# EAGLE design Open_Notify (EAGLE 5.11)
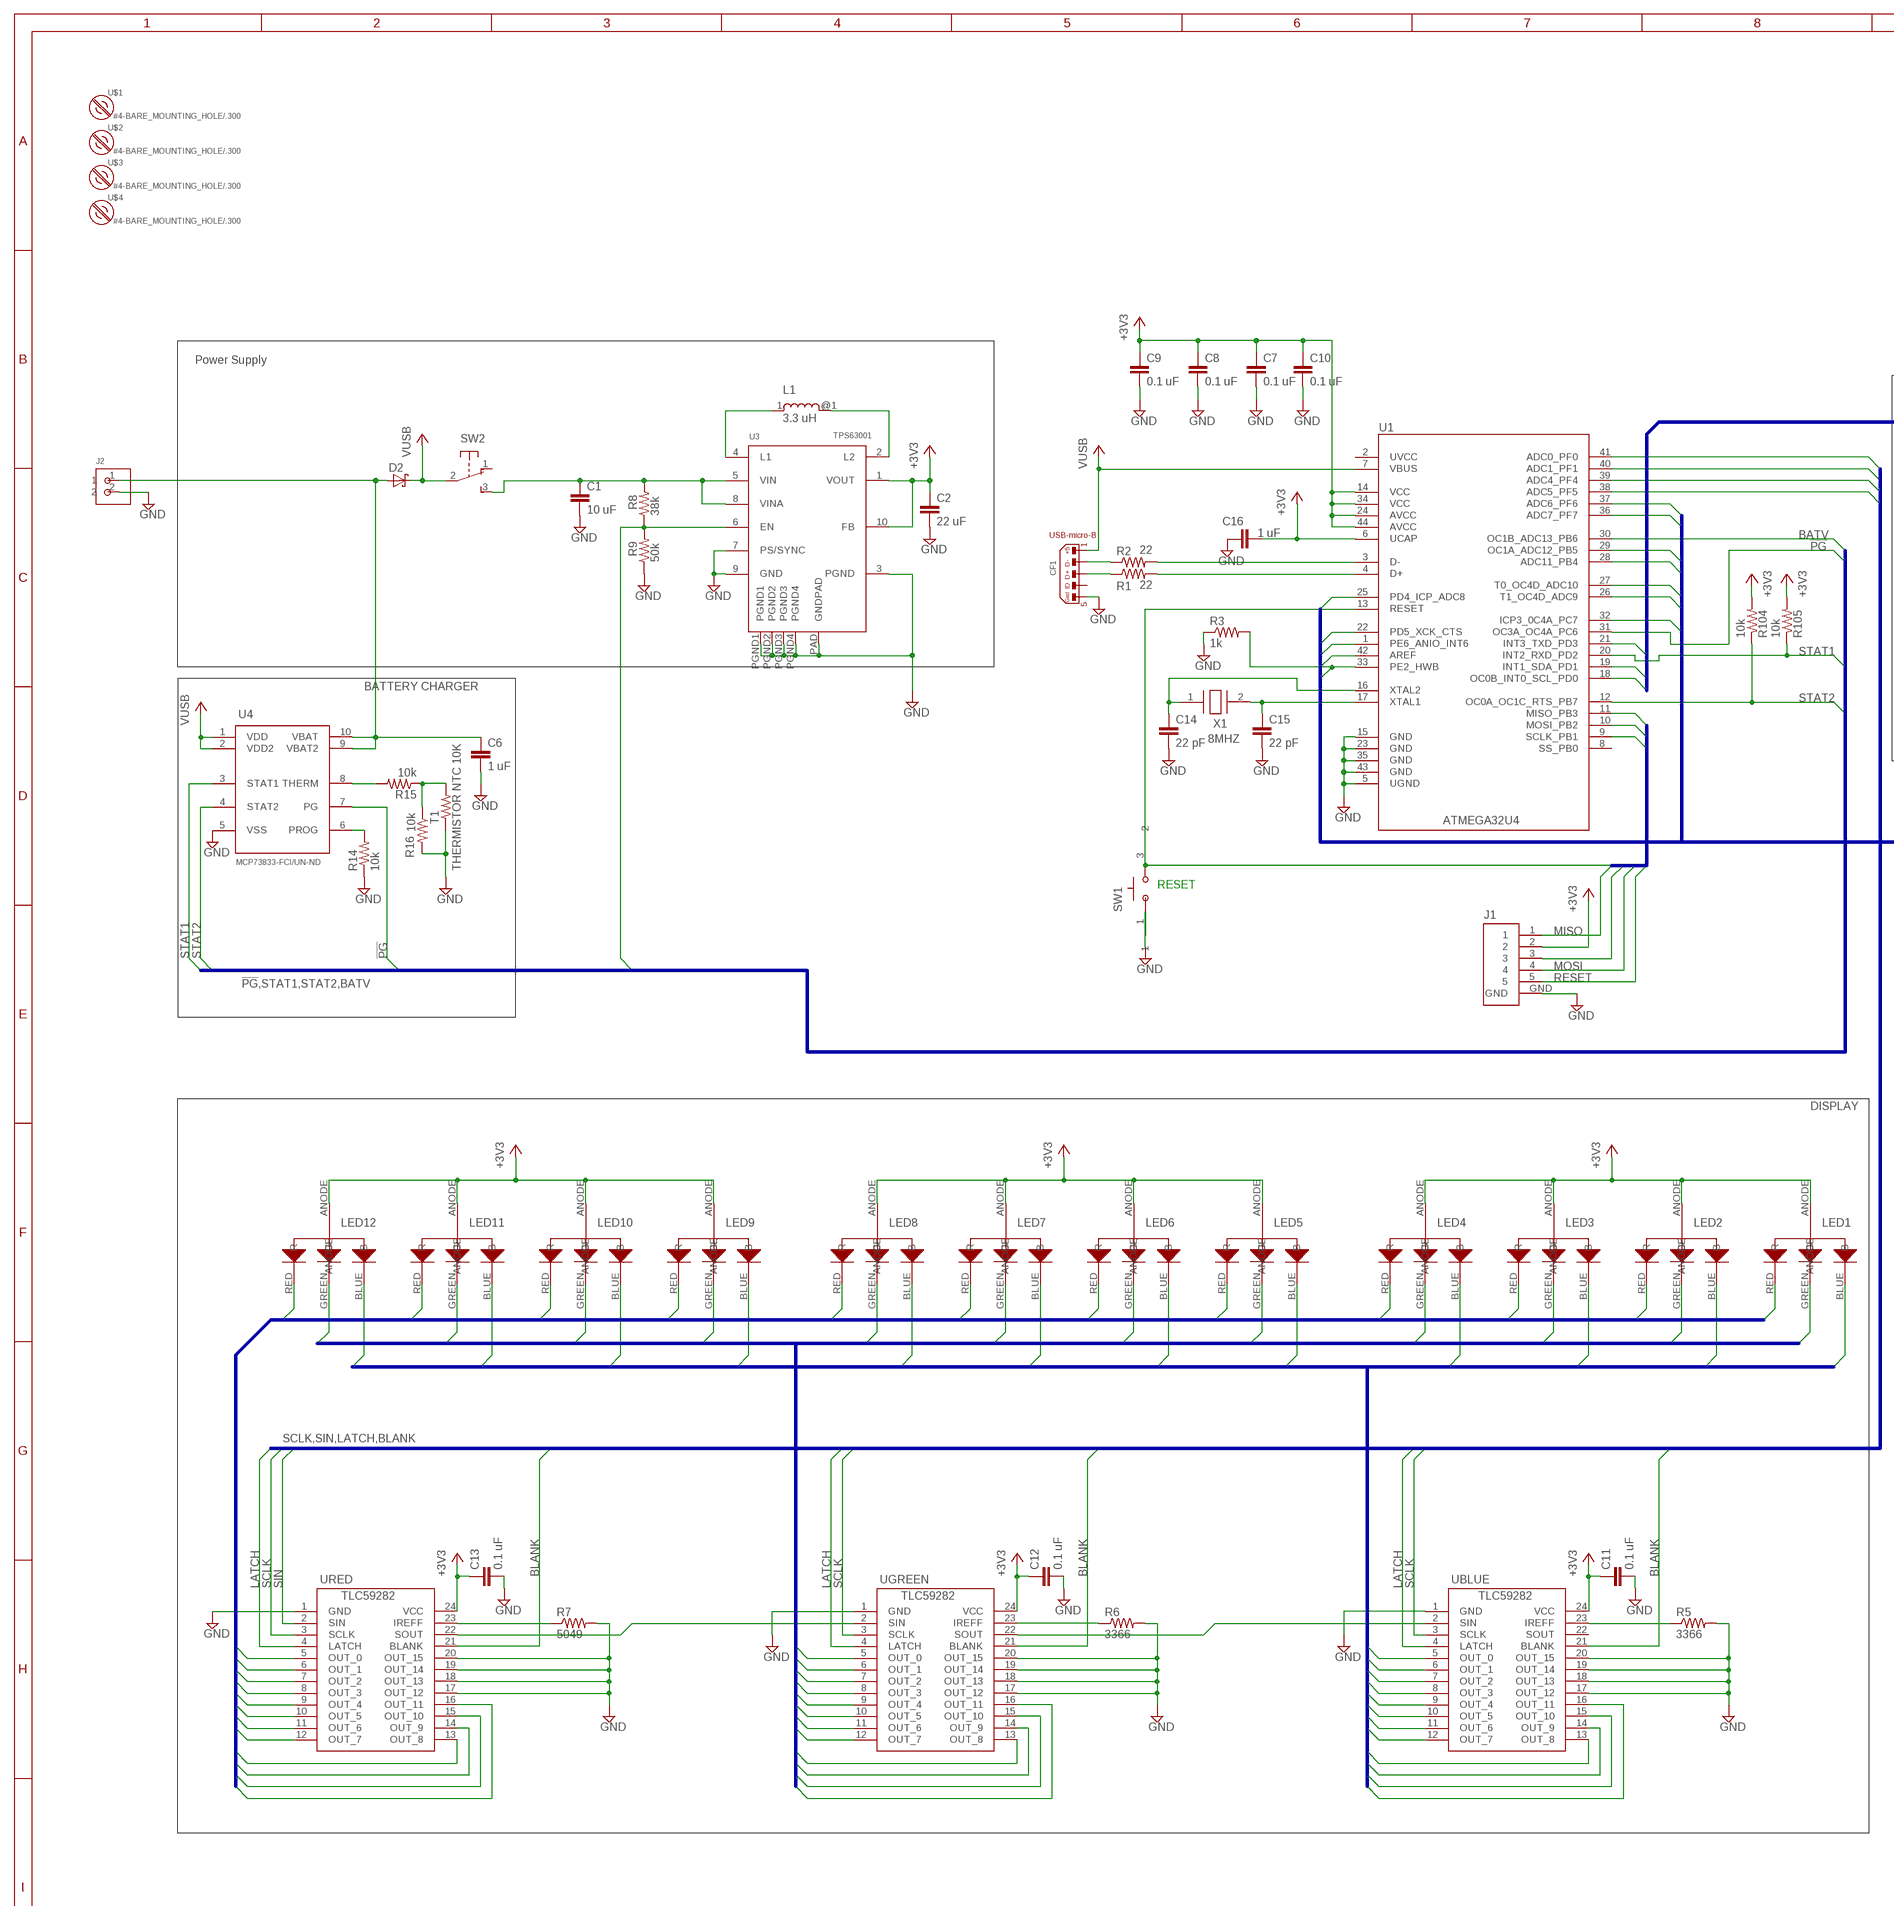
[diagram p0: schematic, sheet 1, part 1 of 2]
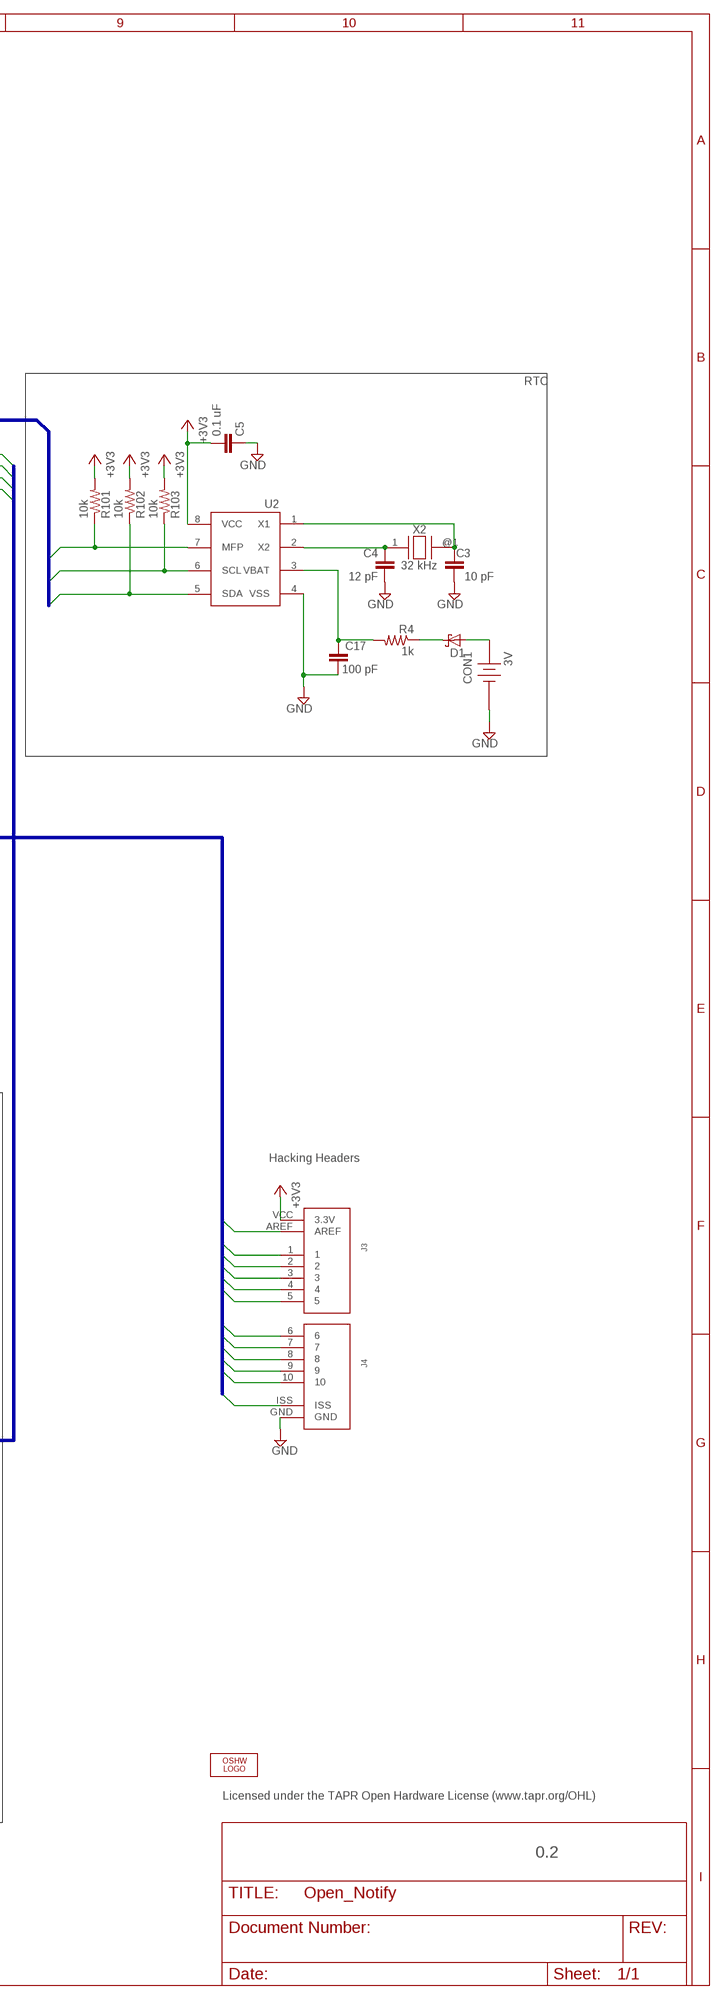
[diagram p1: schematic, sheet 1, part 2 of 2]

## Parts
C1  10 uF  C-EUC0805  [C0805]
C2  22 uF  C-EUC0805  [C0805]
C3  10 pF  C-EUC0805  [C0805]
C4  12 pF  C-EUC0805  [C0805]
C5  0.1 uF  C-EUC0805  [C0805]
C6  1 uF  C-EUC0805  [C0805]
C7  0.1 uF  C-EUC0805  [C0805]
C8  0.1 uF  C-EUC0805  [C0805]
C9  0.1 uF  C-EUC0805  [C0805]
C10  0.1 uF  C-EUC0805  [C0805]
C11  0.1 uF  C-EUC0805  [C0805]
C12  0.1 uF  C-EUC0805  [C0805]
C13  0.1 uF  C-EUC0805  [C0805]
C14  22 pF  C-EUC0805  [C0805]
C15  22 pF  C-EUC0805  [C0805]
C16  1 uF  C-EUC0805  [C0805]
C17  100 pF  C-EUC0805  [C0805]
CF1  CON_USB-MICRO-6GND  [USBMICROSMT]
CON1  3V  COINCELL  [COINCELL]
D1  MBR120  [MBR120]
D2  MBR120  [MBR120]
J1  AVRISP  [AVRISP]
J2  JST2  [JSTHEAD]
J3  PROTOSPACE  [PROTOSPACE]
J4  PROTOSPACE2  [PROTOSPACE2]
L1  3.3 uH  CB2518  [SMD1007]
LED1  RGBLED  [SMDRGBLED]
LED2  RGBLED  [SMDRGBLED]
LED3  RGBLED  [SMDRGBLED]
LED4  RGBLED  [SMDRGBLED]
LED5  RGBLED  [SMDRGBLED]
LED6  RGBLED  [SMDRGBLED]
LED7  RGBLED  [SMDRGBLED]
LED8  RGBLED  [SMDRGBLED]
LED9  RGBLED  [SMDRGBLED]
LED10  RGBLED  [SMDRGBLED]
LED11  RGBLED  [SMDRGBLED]
LED12  RGBLED  [SMDRGBLED]
LOGO1  OSHW_LOGO_FILLX0100-NT  [OSHW_FILLX100_NOTEXT]
R1  22  R-US_R0805  [R0805]
R2  22  R-US_R0805  [R0805]
R3  1k  R-US_R0805  [R0805]
R4  1k  R-US_R0805  [R0805]
R5  3366  R-US_R0805  [R0805]
R6  3366  R-US_R0805  [R0805]
R7  5049  R-US_R0805  [R0805]
R8  38k  R-US_R0805  [R0805]
R9  50k  R-US_R0805  [R0805]
R14  10k  R-US_R0805  [R0805]
R15  10k  R-US_R0805  [R0805]
R16  10k  R-US_R0805  [R0805]
R101  10k  R-US_R0805  [R0805]
R102  10k  R-US_R0805  [R0805]
R103  10k  R-US_R0805  [R0805]
R104  10k  R-US_R0805  [R0805]
R105  10k  R-US_R0805  [R0805]
SW1  SWITCH  [SWITCH]
SW2  9077-1  [ESWITCH]
T1  THERMISTOR NTC 10K  R-US_R0805  [R0805]
U1  ATMEGA32U4  [TQFP-44]
U2  MCP7940N  [MCP7940N]
U3  TPS63001  [QFN10]
U4  MCP73833  [10-MSOP]
U$1  #4-BARE_MOUNTING_HOLE/.300  [#4/.300-BARE+STD_NUT_OR_STAR_WASHER]
U$2  #4-BARE_MOUNTING_HOLE/.300  [#4/.300-BARE+STD_NUT_OR_STAR_WASHER]
U$3  #4-BARE_MOUNTING_HOLE/.300  [#4/.300-BARE+STD_NUT_OR_STAR_WASHER]
U$4  #4-BARE_MOUNTING_HOLE/.300  [#4/.300-BARE+STD_NUT_OR_STAR_WASHER]
UBLUE  TLC59282  [24SSOP]
UGREEN  TLC59282  [24SSOP]
URED  TLC59282  [24SSOP]
X1  8MHZ  8MHZXTAL  [8MHXTAL]
X2  32 kHz  ABS10  [ABS10]

## Nets
!PG: U1.31(OC3A_OC4A_PC6) U4.7(PG)
+3V3: C2.1 C5.2 C7.1 C8.1 C9.1 C10.1 C11.1 C12.1 C13.1 C16.1 J1.2 J3.VCC(3.3V) LED1.ANODE LED2.ANODE LED3.ANODE LED4.ANODE LED5.ANODE LED6.ANODE LED7.ANODE LED8.ANODE LED9.ANODE LED10.ANODE LED11.ANODE LED12.ANODE R101.2 R102.2 R103.2 R104.2 R105.2 U1.6(UCAP) U1.14(VCC) U1.24(AVCC) U1.34(VCC) U1.44(AVCC) U2.8(VCC) U3.1(VOUT) U3.10(FB) UBLUE.24(VCC) UGREEN.24(VCC) URED.24(VCC)
B1: LED1.BLUE(B) UBLUE.5(OUT_0)
B2: LED2.BLUE(B) UBLUE.6(OUT_1)
B3: LED3.BLUE(B) UBLUE.7(OUT_2)
B4: LED4.BLUE(B) UBLUE.8(OUT_3)
B5: LED5.BLUE(B) UBLUE.9(OUT_4)
B6: LED6.BLUE(B) UBLUE.10(OUT_5)
B7: LED7.BLUE(B) UBLUE.11(OUT_6)
B8: LED8.BLUE(B) UBLUE.12(OUT_7)
B9: LED9.BLUE(B) UBLUE.13(OUT_8)
B10: LED10.BLUE(B) UBLUE.14(OUT_9)
B11: LED11.BLUE(B) UBLUE.15(OUT_10)
B12: LED12.BLUE(B) UBLUE.16(OUT_11)
BATV: R8.1 R9.2 U1.30(OC1B_ADC13_PB6) U3.6(EN)
BLANK: U1.38(ADC5_PF5) UBLUE.21(BLANK) UGREEN.21(BLANK) URED.21(BLANK)
D+: R1.2 U1.4(D+)
D-: R2.2 U1.3(D-)
G1: LED1.GREEN(G) UGREEN.5(OUT_0)
G2: LED2.GREEN(G) UGREEN.6(OUT_1)
G3: LED3.GREEN(G) UGREEN.7(OUT_2)
G4: LED4.GREEN(G) UGREEN.8(OUT_3)
G5: LED5.GREEN(G) UGREEN.9(OUT_4)
G6: LED6.GREEN(G) UGREEN.10(OUT_5)
G7: LED7.GREEN(G) UGREEN.11(OUT_6)
G8: LED8.GREEN(G) UGREEN.12(OUT_7)
G9: LED9.GREEN(G) UGREEN.13(OUT_8)
G10: LED10.GREEN(G) UGREEN.14(OUT_9)
G11: LED11.GREEN(G) UGREEN.15(OUT_10)
G12: LED12.GREEN(G) UGREEN.16(OUT_11)
GND: C1.2 C2.2 C3.2 C4.2 C5.1 C6.2 C7.2 C8.2 C9.2 C10.2 C11.2 C12.2 C13.2 C14.2 C15.2 C16.2 C17.2 CF1.5 CON1.GND J1.GND J2.2 J4.GND R3.1 R5.2 R6.2 R7.2 R9.1 R14.1 R16.2 SW1.1 T1.1 U1.5(UGND) U1.15(GND) U1.23(GND) U1.35(GND) U1.43(GND) U2.4(VSS) U3.3(PGND) U3.7(PS/SYNC) U3.9(GND) U3.PAD(GNDPAD) U3.PGND1 U3.PGND2 U3.PGND3 U3.PGND4 U4.5(VSS) UBLUE.1(GND) UBLUE.17(OUT_12) UBLUE.18(OUT_13) UBLUE.19(OUT_14) UBLUE.20(OUT_15) UGREEN.1(GND) UGREEN.17(OUT_12) UGREEN.18(OUT_13) UGREEN.19(OUT_14) UGREEN.20(OUT_15) URED.1(GND) URED.17(OUT_12) URED.18(OUT_13) URED.19(OUT_14) URED.20(OUT_15)
ISCLK: J1.3 U1.9(SCLK_PB1)
LATCH: U1.39(ADC4_PF4) UBLUE.4(LATCH) UGREEN.4(LATCH) URED.4(LATCH)
MISO: J1.1 U1.11(MISO_PB3)
MOSI: J1.4 U1.10(MOSI_PB2)
N$1: CF1.D- R2.1
N$2: CF1.D+ R1.1
N$3: R14.2 U4.6(PROG)
N$4: C17.1 R4.2 U2.3(VBAT)
N$5: CON1.POS1(VBAT) D1.A
N$6: D1.C R4.1
N$7: C4.1 U2.2(X2) X2.1
N$8: R15.1 R16.1 T1.2
N$10: C3.1 U2.1(X1) X2.@1
N$12: L1.1 U3.4(L1)
N$14: L1.@1 U3.2(L2)
N$15: R15.2 U4.8(THERM)
N$18: UGREEN.2(SIN) URED.22(SOUT)
N$19: UBLUE.2(SIN) UGREEN.22(SOUT)
N$21: R7.1 URED.23(IREFF)
N$22: R6.1 UGREEN.23(IREFF)
N$23: R5.1 UBLUE.23(IREFF)
N$56: C15.1 U1.17(XTAL1) X1.2
N$57: C14.1 U1.16(XTAL2) X1.1
P1: J3.1 U1.37(ADC6_PF6)
P2: J3.2 U1.36(ADC7_PF7)
P3: J3.3 U1.29(OC1A_ADC12_PB5)
P4: J3.4 U1.28(ADC11_PB4)
P5: J3.5 U1.27(T0_OC4D_ADC10)
P6: J4.6 U1.26(T1_OC4D_ADC9)
P7: J4.7 U1.32(ICP3_0C4A_PC7)
P8: J4.8 U1.22(PD5_XCK_CTS)
P9: J4.9 U1.1(PE6_ANIO_INT6)
P10: J4.10 R3.2 U1.33(PE2_HWB)
P_AREF: J3.AREF U1.42(AREF)
P_ISS: J4.ISS U1.25(PD4_ICP_ADC8)
R1: LED1.RED(R) URED.5(OUT_0)
R2: LED2.RED(R) URED.6(OUT_1)
R3: LED3.RED(R) URED.7(OUT_2)
R4: LED4.RED(R) URED.8(OUT_3)
R5: LED5.RED(R) URED.9(OUT_4)
R6: LED6.RED(R) URED.10(OUT_5)
R7: LED7.RED(R) URED.11(OUT_6)
R8: LED8.RED(R) URED.12(OUT_7)
R9: LED9.RED(R) URED.13(OUT_8)
R10: LED10.RED(R) URED.14(OUT_9)
R11: LED11.RED(R) URED.15(OUT_10)
R12: LED12.RED(R) URED.16(OUT_11)
RESET: J1.5 SW1.3 U1.13(RESET)
RTC-ALARM: R101.1 U1.21(INT3_TXD_PD3) U2.7(MFP)
RTC-SCL: R103.1 U1.18(OC0B_INT0_SCL_PD0) U2.6(SCL)
RTC-SDA: R102.1 U1.19(INT1_SDA_PD1) U2.5(SDA)
SCLK: U1.41(ADC0_PF0) UBLUE.3(SCLK) UGREEN.3(SCLK) URED.3(SCLK)
SIN: U1.40(ADC1_PF1) URED.2(SIN)
STAT1: R105.1 U1.20(INT2_RXD_PD2) U4.3(STAT1)
STAT2: R104.1 U1.12(OC0A_OC1C_RTS_PB7) U4.4(STAT2)
VBAT: C6.1 D2.A J2.1 U4.9(VBAT2) U4.10(VBAT)
VIN: C1.1 R8.2 SW2.3(S) U3.5(VIN) U3.8(VINA)
VUSB: CF1.VUSB D2.C SW2.2(P) U1.7(VBUS) U4.1(VDD) U4.2(VDD2)
Unconnected: CF1.4 SW2.1(O) U1.8(SS_PB0) UBLUE.22(SOUT)

## Buses
RTC-ALARM,RTC-SCL,RTC-SDA
!PG,STAT1,STAT2,BATV
R1,R2,R3,R4,R5,R6,R7,R8,R9,R10,R11,R12
G1,G2,G3,G4,G5,G6,G7,G8,G9,G10,G11,G12
B1,B2,B3,B4,B5,B6,B7,B8,B9,B10,B11,B12
SCLK,SIN,LATCH,BLANK
MISO,MOSI,ISCLK,RESET
P1,P2,P3,P4,P5,P6,P7,P8,P9,P10,P_ISS,P_AREF

## Notes on the sheet
- Power Supply
- RTC
- BATTERY CHARGER
- ATMEGA32U4
- RESET
- DISPLAY
- Hacking Headers
- TLC59282 | TLC59282 | TLC59282
- Licensed under the TAPR Open Hardware License (www.tapr.org/OHL)
- 0.2

## Power pins joined to a net without a drawn wire
UVCC: U1.2(UVCC)

## Library data of the parts
C1-C17 = rcl:C-EU: CAPACITOR, European symbol
CF1 = parts:CON_USB-MICRO-6GND: Micro USB connector
CON1 = parts:COINCELL
D1 D2 = parts:MBR120: Schottky Power Rectifier
J1 = parts:AVRISP: ISP header for AVR
J2 = parts:JST2
J3 = parts:PROTOSPACE
J4 = parts:PROTOSPACE2
L1 = parts:CB2518: 3.3 uH Inductor
LED1-LED12 = parts:RGBLED
LOGO1 = OSHW:OSHW_LOGO_FILL
R1-R9 R14-R16 R101-R105 T1 = resistor:R-US_: RESISTOR, American symbol
SW1 = parts:SWITCH: Tall micro push button
SW2 = parts:9077-1: MARQUARDT SWITCH 9077.0100 Distributor: Buerklin <https://www.buerklin.com/default.asp?event=ShowArtikel%2812G2820%29&l=d&jump=ArtNr_12G2820>
U1 = parts:ATMEGA32U4: ATMega32U4 AVR embedded microcontroller with USB, UART, SPI, I2C, 32K program space, 1K eeprom, 2.5 K sram
U2 = parts:MCP7940N: Low Power Real Time Clock
U3 = parts:TPS63001: High efficiency buck boost SPS
U4 = parts:MCP73833
U$1-U$4 = mount:#4-BARE_MOUNTING_HOLE: 1/8" drill hole for #4 screw mount
UBLUE UGREEN URED = parts:TLC59282
X1 = parts:8MHZXTAL
X2 = parts:ABS10: 32.768 kHz Crystal 7 pF

## Board
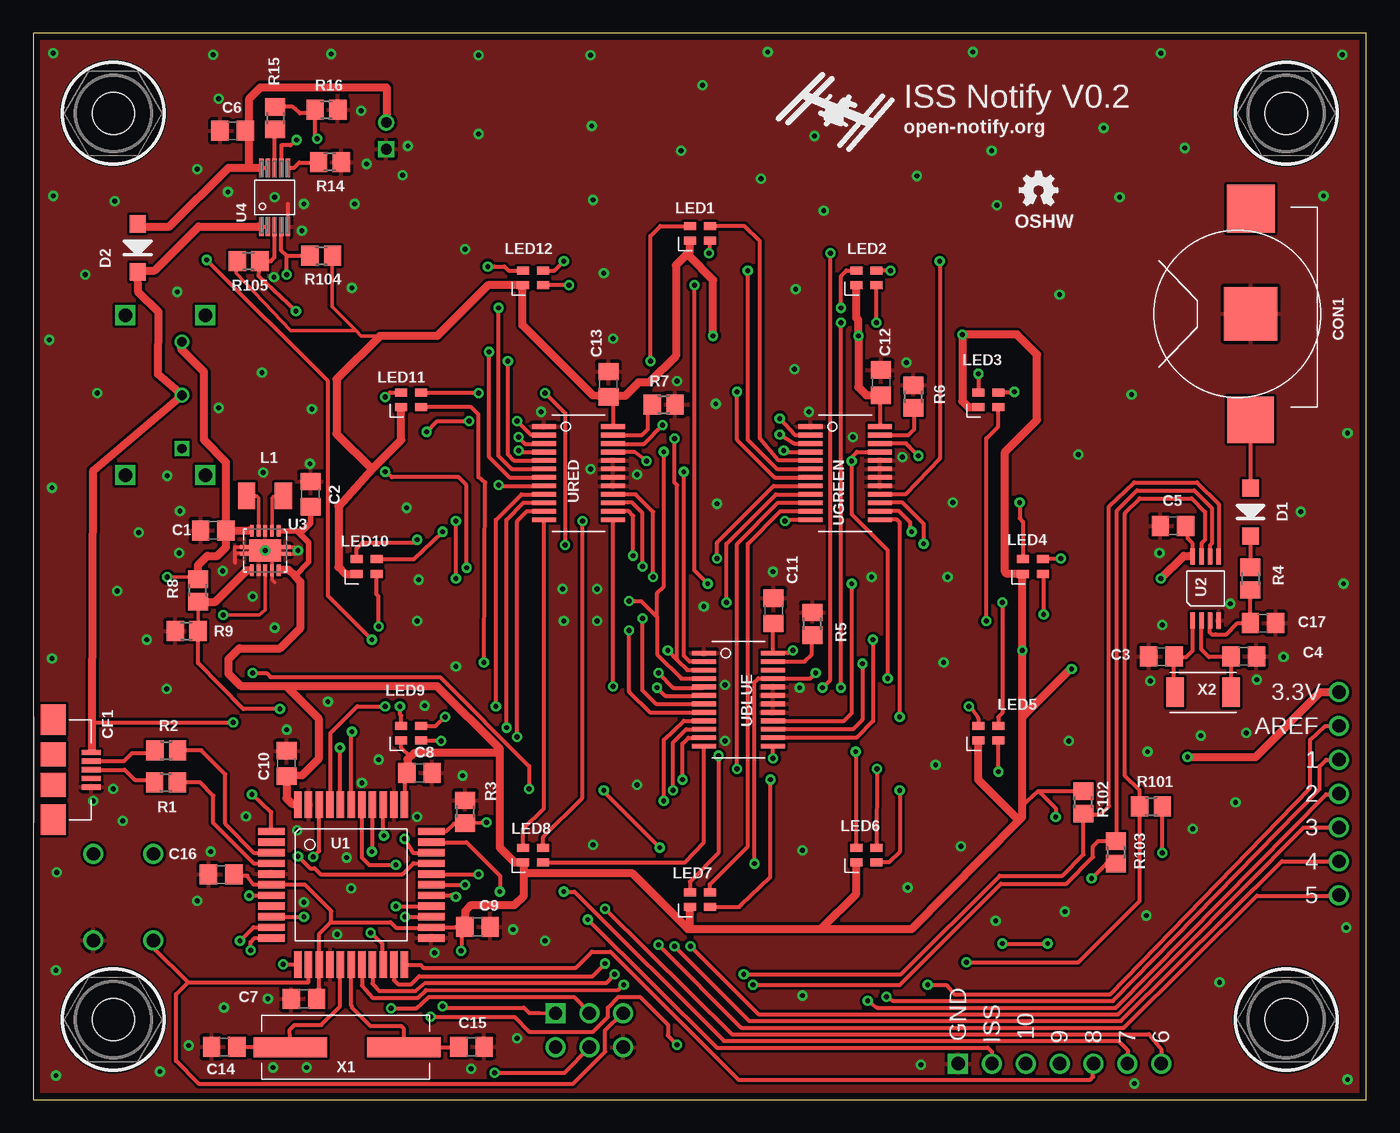
[diagram p2: board, top side]
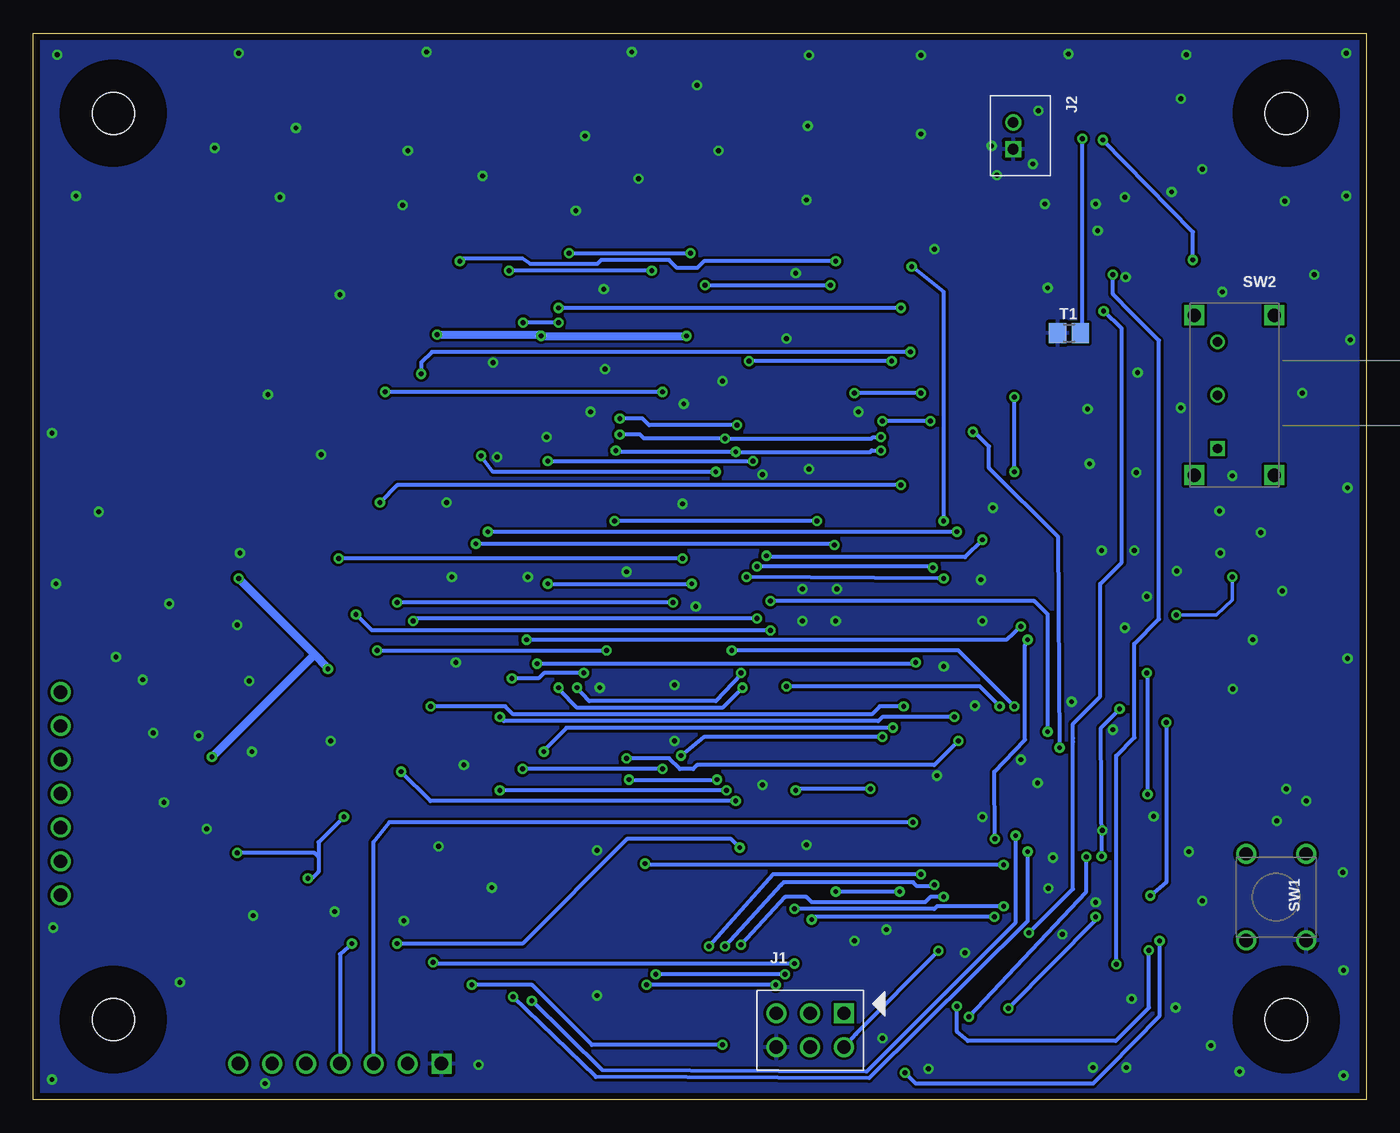
[diagram p3: board, bottom side, seen from below]

Size 100 x 80 mm. Coordinates in mm from the lower left corner, seen from the top.
Outline: 0,0 100,0 100,80 0,80 0,0
Copper layers (1*16): Top 0.0178mm / dielectric 1.4986mm / Bottom 0.0178mm
Design rules "sunstone_eagle_2lyr_rules_v1.0.0.3": minimum track width 6mil, minimum drill 14mil, track to track 6mil, track to pad 6mil, pad to pad 6mil, via to via 6mil, smd to smd 6mil, copper to edge 20mil, drill to drill 16mil, minimum pad ring 8mil, minimum via ring 8mil, stop-mask expansion 3mil, vias tented up to drill 0mil, thermal gap 10mil

### Footprints (pad centres in the part's own frame; a part is rotated, then mirrored left to right if it is on the bottom)
C0805 = smd 1.3 x 1.5: 1 -0.95,0; 2 0.95,0
USBMICROSMT = smd 0.4 x 1.4: 4 0.65,2.85; 5 1.3,2.85; D+ 0,2.85; D- -0.65,2.85; VUSB -1.3,2.85 | smd 2.3 x 1.9: GND -3.75,0; GND3 3.75,0 | smd 1.8 x 1.9: GND1 -1.15,0; GND2 1.15,0
COINCELL = smd 4 x 4: GND 0,0 | smd 3.5 x 3.5: POS1 -7.95,0 | smd 3.6 x 3.6: POS2 7.9,0
MBR120 = smd 1.3 x 1.22: A 1.8,0; C -1.8,0
AVRISP = drill 1 square: 1 -1.27,2.54 | drill 1 round: 2 1.27,2.54; 3 -1.27,0; 4 1.27,0; 5 -1.27,-2.54; GND 1.27,-2.54
JSTHEAD = drill 0.8 round: 1 -1,0 | drill 0.8 square: 2 1,0
PROTOSPACE = drill 1 round: 1 -2.54,0; 2 0,0; 3 2.54,0; 4 5.08,0; 5 7.62,0; AREF -5.08,0; VCC -7.62,0
PROTOSPACE2 = drill 1 round: 6 -7.62,0; 7 -5.08,0; 8 -2.54,0; 9 0,0; 10 2.54,0; ISS 5.08,0 | drill 1 square: GND 7.62,0
SMD1007 = smd 1.3 x 2: 1 -1.4,0; @1 1.35,0
SMDRGBLED = smd 0.9 x 0.6: ANODE -0.75,-0.55; BLUE 0.75,-0.55; GREEN 0.75,0.55; RED -0.75,0.55
R0805 = smd 1.3 x 1.5: 1 -0.85,0; 2 0.85,0
SWITCH = drill 1 round: 1 -3.25,-2.25; 2 3.25,-2.25; 3 -3.25,2.25; 4 3.25,2.25
ESWITCH = drill 0.7 square: 1 -4,0 | drill 0.7 round: 2 0,0; 3 4,0 | drill 1 square: CASE@1 -6,-4.25; CASE@2 6,-4.25; CASE@3 6,1.75; CASE@4 -6,1.75
TQFP-44 = smd 2 x 0.56: 1 -6,4; 2 -6,3.2; 3 -6,2.4; 4 -6,1.6; 5 -6,0.8; 6 -6,0; 7 -6,-0.8; 8 -6,-1.6; 9 -6,-2.4; 10 -6,-3.2; 11 -6,-4; 23 6,-4; 24 6,-3.2; 25 6,-2.4; 26 6,-1.6; 27 6,-0.8; 28 6,0; 29 6,0.8; 30 6,1.6; 31 6,2.4; 32 6,3.2; 33 6,4 | smd 0.56 x 2: 12 -4,-6; 13 -3.2,-6; 14 -2.4,-6; 15 -1.6,-6; 16 -0.8,-6; 17 0,-6; 18 0.8,-6; 19 1.6,-6; 20 2.4,-6; 21 3.2,-6; 22 4,-6; 34 4,6; 35 3.2,6; 36 2.4,6; 37 1.6,6; 38 0.8,6; 39 0,6; 40 -0.8,6; 41 -1.6,6; 42 -2.4,6; 43 -3.2,6; 44 -4,6
MCP7940N = smd 0.34 x 1.19: 1 -0.975,-2.4; 2 -0.325,-2.4; 3 0.325,-2.4; 4 0.975,-2.4; 5 0.975,2.4; 6 0.325,2.4; 7 -0.325,2.4; 8 -0.975,2.4
QFN10 = smd 0.28 x 0.85: 1 -1,-1.475; 2 -0.5,-1.475; 3 0,-1.475; 4 0.5,-1.475; 5 1,-1.475; 6 1,1.475; 7 0.5,1.475; 8 0,1.475; 9 -0.5,1.475; 10 -1,1.475 | smd 2.4 x 1.65: PAD 0,0 | smd 0.7 x 0.28: PGND1 1.55,0.25; PGND2 -1.55,0.25; PGND3 -1.55,-0.25; PGND4 1.55,-0.25
10-MSOP = smd 0.33 x 1.4: 1 -1,-2.2; 2 -0.5,-2.2; 3 0,-2.2; 4 0.5,-2.2; 5 1,-2.2; 6 1,2.2; 7 0.5,2.2; 8 0,2.2; 9 -0.5,2.2; 10 -1,2.2
#4/.300-BARE+STD_NUT_OR_STAR_WASHER = hole 3.175: 0,0
24SSOP = smd 0.35 x 1.8: 1 -3.493,-2.6; 2 -2.857,-2.6; 3 -2.223,-2.6; 4 -1.587,-2.6; 5 -0.953,-2.6; 6 -0.318,-2.6; 7 0.318,-2.6; 8 0.953,-2.6; 9 1.587,-2.6; 10 2.223,-2.6; 11 2.857,-2.6; 12 3.493,-2.6; 13 3.493,2.6; 14 2.857,2.6; 15 2.223,2.6; 16 1.587,2.6; 17 0.953,2.6; 18 0.318,2.6; 19 -0.318,2.6; 20 -0.953,2.6; 21 -1.587,2.6; 22 -2.223,2.6; 23 -2.857,2.6; 24 -3.493,2.6
8MHXTAL = smd 5.5 x 1.5: 1 -4.25,0; 2 4.25,0
ABS10 = smd 1.3 x 2.2: 1 -2.1,0; @1 2.1,0

### Placement (x,y rotation side)
C1  13.5,42.7 180 top
C2  20.79,45.42 90 top
C3  84.63,33.24 180 top
C4  90.82,33.26 0 top
C5  85.5,43.04 0 top
C6  14.96,72.69 180 top
C7  20.3,7.56 180 top
C8  28.97,24.51 0 top
C9  33.32,12.96 0 top
C10  18.99,25.22 90 top
C11  55.54,36.67 90 top
C12  63.6,53.8 90 top
C13  43.14,53.67 90 top
C14  14.33,3.94 180 top
C15  32.87,3.96 0 top
C16  14.09,16.89 180 top
C17  92.25,35.74 0 top
CF1  1.49,24.75 270 top
CON1  91.33,58.96 90 top
D1  91.33,44.08 90 top
D2  7.83,63.9 90 top
J1  41.72,5.2 270 bottom
J2  26.48,72.31 270 bottom
J3  97.96,22.95 270 top
J4  77,2.7 180 top
L1  17.41,45.29 0 top
LED1  50,65 0 top
LED2  62.5,61.65 0 top
LED3  71.65,52.5 0 top
LED4  75,40 0 top
LED5  71.65,27.5 0 top
LED6  62.5,18.34 0 top
LED7  50,15 0 top
LED8  37.5,18.34 0 top
LED9  28.35,27.5 0 top
LED10  25,40 0 top
LED11  28.35,52.5 0 top
LED12  37.5,61.65 0 top
LOGO1  74,67.1 0 top
R1  9.96,23.81 0 top
R2  9.98,26.21 0 top
R3  32.41,21.6 270 top
R4  91.31,39.08 270 top
R5  58.44,35.69 90 top
R6  66.04,52.74 90 top
R7  47.29,52.16 0 top
R8  12.35,38.2 90 top
R9  11.5,35.15 0 top
R14  22.25,70.34 180 top
R15  18.16,73.63 270 top
R16  21.99,74.26 0 top
R101  83.85,22.01 0 top
R102  78.79,22.3 90 top
R103  81.21,18.55 270 top
R104  21.6,63.31 0 top
R105  16.15,62.89 180 top
SW1  6.76,15.18 90 bottom
SW2  11.15,52.85 90 bottom
T1  22.3,57.51 0 bottom
U1  23.85,16.12 0 top
U2  87.96,38.34 0 top
U3  17.4,41.2 180 top
U4  18.1,67.7 0 top
U$1  94,6 0 top
U$2  94,74 0 top
U$3  6,74 0 top
U$4  6,6 0 top
UBLUE  52.9,30 270 top
UGREEN  60.9,47 270 top
URED  40.9,47 270 top
X1  23.54,3.92 0 top
X2  87.76,30.56 180 top

### Tracks (layer width: path | path; a pad name or v marks a point on that pad's centre or on a via)
!PG  (via drill 0.36)
  Top 0.305: U1.31 28.48,18.52 v27.85,19.55 | v25.4,34.5 22.1,37.8 22.1,53.9 v13,63 | U4.7 18.6,71.6 19.3,71.6 v19.75,72
  Bottom 0.305: v27.85,19.55 27.9,24.6 25.6,27 25.6,34.1 v25.4,34.5 | v13,63 13,65.1 v19.75,72
+3V3  (via drill 0.36)
  Top 0.254: 26,57.3 24.6,57.3 24.2,57.7 | 24.2,57.7 22.4,59.5 22.4,63.36 R104.2 | R105.2 15.2,62 19.3,57.7 24.2,57.7 | U3.10 18.48,39.77 18.6,39.75 | U1.44 19.68,22.12 19.6,22.2 | 18.5,42.65 18.4,42.65 U3.1
  Top 0.305: C5.2 86.6,42.99 86.6,42.1 86.98,41.72 U2.8 86.83,40.77 86.8,40.8 | URED.24 43.5,52.78 C13.1 | UGREEN.24 63.5,52.75 C12.1 | C11.1 55.5,35.68 UBLUE.24 56.6,33.5 v57,33.7 | C7.1 21.45,8.41 U1.14 21.45,12.45 22.3,13.3 | U1.34 27.85,24 27.95,24.7 27.95,24.58 C8.1 | 24.3,39.4 LED10.ANODE 24.2,39.4 | 36.7,61.05 LED12.ANODE | C13.1 43.56,52.8 | 43.22,52.8 C13.1 | 49.25,63.25 49.25,63.65 | 74.2,39.4 LED4.ANODE | 75.4,23.15 74.15,22.05 74.2,23.2 | 75.4,23.15 R102.2 | R103.2 80.5,17.7 v79.4,16.6 | v76.7,21.2 76.7,21.85 75.4,23.15 | v84.7,18.5 R101.2 | 36.8,17 36.75,17.05 | 36.8,17.74 LED8.ANODE | v32.1,11.15 32.15,12.79 C9.1 31.68,12.92 U1.24 29.33,12.9 27.2,12.9 26.8,13.3 22.3,13.3 | v77.9,32.3 77.8,32.2 77.7,32.2 | 28.6,26 28.3,25.7 27.6,26.4 LED9.ANODE | C16.1 15.68,16.8 16.05,16.8 16.54,16.11 17.44,16.11 U1.6 20.38,16.12 22.35,14.15 22.35,13.35 22.3,13.3
  Top 0.406: 19.8,42.65 18.5,42.65 | 19.8,42.65 20.65,41.8 20.65,40.33 19.65,39.28 | 19.8,42.65 20.2,42.65 20.8,43.25 C2.1
  Top 0.61: LED11.ANODE 27.6,49.5 25.4,47.3 | 25.4,47.3 22.9,44.5 22.9,39.95 23.4,39.45 LED10.ANODE | 25.4,47.3 22.75,49.95 22.75,54.05 26,57.3 30.3,57.3 34.1,61.1 LED12.ANODE | C13.1 41.98,52.82 36.7,58.1 36.7,61.05 | LED1.ANODE 49.25,63.65 48.2,62.6 48.2,55.8 46.2,53.8 45.4,53.8 44.4,52.8 43.22,52.8 | 49.25,63.25 51,61.5 v51,57.3 | LED3.ANODE 70.15,51.95 69.7,52.4 v69.7,57.4 73.8,57.4 75.3,55.9 75.3,51 72.9,48.6 72.9,39.6 73.05,39.45 LED4.ANODE | 74.2,28.7 74.2,23.2 74.2,21.2 73.95,20.95 | 74.2,28.7 v74.2,33.7 74.2,39.4 | 73.95,20.95 65.9,12.8 59.1,12.8 | LED6.ANODE 61.75,15.45 59.1,12.8 | LED5.ANODE 70.9,24 73.95,20.95 | 36.8,17 44.9,17 49.02,12.88 | 49.02,12.88 49.1,12.8 59.1,12.8 | 35,26 35,18.9 36.11,17.79 LED8.ANODE | 35,26 35,26.3 30.3,31 19,31 | 36.8,17 36.8,17.74 | C9.1 32.42,14.12 32.85,14.6 36.1,14.6 36.8,15.3 36.8,17 | C8.1 28.07,25.52 28.6,26 35,26 | 19,31 21.4,28.6 21.4,25.55 20.17,24.32 C10.1 19,24.53 19,22.6 19.4,22.2 19.6,22.2 | 74.2,28.7 77.7,32.2 | 86.8,40.8 86.3,40.8 v84.6,39.1 | J3.VCC 96.57,30.57 91.7,25.7 v86.6,25.7 | 18.6,39.75 19.15,39.75 19.65,39.28 20.05,38.85 20.05,35.4 18.5,33.85 15.45,33.85 14.65,33.05 14.65,31.95 15.6,31 19,31 | LED7.ANODE 49.25,13.1 49.02,12.88 | LED2.ANODE 61.75,58.65 61.9,58.5 v61.9,57.3 61.9,53.45 62.5,52.85 C12.1
  Bottom 0.305: 62,57.4 v61.9,57.3 | v79.4,16.6 79.1,16.6 78.6,17.1 78.6,18.2 | 78.6,18.2 78.6,19.3 v76.7,21.2 | v84.7,18.5 78.9,18.5 78.6,18.2 | J1.2 38.27,4.93 v32.1,11.15 | v77.9,32.3 77.9,32.4 | v74.2,33.7 v57,33.7
  Bottom 0.61: v61.9,57.3 v51,57.3 | v69.7,57.4 62,57.4 | 77.9,32.4 78.9,33.4 | 78.9,33.4 v84.6,39.1 | 78.9,33.4 v86.6,25.7
B1  (via drill 0.36)
  Top 0.305: LED1.BLUE 50.75,63.85 v50.7,63.5 | v59.8,63.5 59.8,31.5 v59.2,30.9 | v46.9,32 48,30.9 50.25,30.9 UBLUE.5
  Bottom 0.305: v59.8,63.5 v50.7,63.5 | v46.9,32 46.9,31.9 48.8,29.9 58.3,29.9 v59.2,30.9
B2  (via drill 0.36)
  Top 0.3: v63.25,58.3 LED2.BLUE
  Top 0.305: v60.6,30.9 v60.6,58.3 | v46.8,30.9 47.4,30.3 50.28,30.3 UBLUE.6
  Bottom 0.305: v60.6,58.3 v63.25,58.3 | v60.6,30.9 60.5,30.7 59.2,29.4 48.3,29.4 v46.8,30.9
B3  (via drill 0.36)
  Top 0.3: LED3.BLUE 72.4,50.5 71.5,49.6
  Top 0.305: UBLUE.7 46.72,29.68 45.7,30.7 v45.7,36.1 | v71.5,35.9 71.5,49.6
  Bottom 0.305: v45.7,36.1 71.3,36.1 v71.5,35.9
B4  (via drill 0.36)
  Top 0.305: UBLUE.8 46.25,29.05 44.7,30.6 v44.7,35.2 | v75.8,36.4 75.8,39.4 LED4.BLUE
  Bottom 0.305: v44.7,35.2 74.6,35.2 v75.8,36.4
B5  (via drill 0.36)
  Top 0.305: UBLUE.9 48.81,28.41 47.3,27 v47.3,22.4 | v72.4,24.6 LED5.BLUE
  Bottom 0.305: v47.3,22.4 70.2,22.4 v72.4,24.6
B6  (via drill 0.36)
  Top 0.305: UBLUE.10 48.98,27.78 48,26.8 v48,23.2 | v65,23.2 65,18.6 64.2,17.8 LED6.BLUE
  Bottom 0.305: v48,23.2 v65,23.2
B7  (via drill 0.36)
  Top 0.305: UBLUE.11 49.14,27.14 48.7,26.7 v48.7,24 | v55.3,24 55.3,16.7 53.1,14.6 52.95,14.45 LED7.BLUE
  Bottom 0.305: v55.3,24 v48.7,24
B8
  Top 0.305: UBLUE.12 50.3,19.3 48.9,17.8 LED8.BLUE
B9  (via drill 0.36)
  Top 0.3: LED9.BLUE 30.55,26.95 v30.6,26.9
  Top 0.305: v55.5,25.6 UBLUE.13
  Bottom 0.305: v30.6,26.9 32.4,25.1 50.2,25.1 50.5,24.8 51.5,24.8 52.3,25.6 v55.5,25.6
B10  (via drill 0.36)
  Top 0.3: LED10.BLUE 25.75,37.9 25.9,37.75 v25.9,35.5
  Top 0.305: UBLUE.14 61.74,27.14 63,28.4 v63,34.5
  Bottom 0.305: v63,34.5 27,34.5 v25.9,35.5
B11  (via drill 0.36)
  Top 0.305: UBLUE.15 61.48,27.78 62.2,28.5 v62.2,32.7 | v33.8,32.8 33.9,46.3 33.4,46.7 33.4,51.4 32.85,51.95 LED11.BLUE
  Bottom 0.305: v62.2,32.7 33.9,32.7 v33.8,32.8
B12  (via drill 0.36)
  Top 0.305: v49.6,61.1 49.6,39.7 v50.6,38.7 | v61.4,38.7 61.4,29 60.8,28.4 55.51,28.4 UBLUE.16 | v40.2,61.1 LED12.BLUE
  Bottom 0.305: v61.4,38.7 v50.6,38.7 | v49.6,61.1 v40.2,61.1
BATV  (via drill 0.36)
  Top 0.254: R9.2 R8.1 | U3.6 16.23,39.73 16.2,39.7
  Top 0.305: U1.30 28.52,17.72 27.7,16.9 21.55,16.9 21.1,17.35 20.75,17.35 v19.85,18.25 | v18.5,29.3 15.75,29.3 12.35,32.75 R9.2
  Top 0.61: 16.2,39.7 16,39.7 13.65,37.35 R8.1
  Bottom 0.305: v19.85,18.25 19.9,27.9 v18.5,29.3
BLANK  (via drill 0.36)
  Top 0.3: UGREEN.21 61.79,48.59 61.4,48.2
  Top 0.305: URED.21 43.51,48.6 45.1,48.6 v46,47.9 | v64.1,31.6 64.1,41.2 61.4,43.9 v61.4,47.9 61.4,48.2 | v54.1,17.7 54.1,31.3 54.4,31.6 55.49,31.6 UBLUE.21 55.79,31.6 58.3,31.6 v58.7,32 | v27.2,17.6 25.2,17.6 24.65,18.15 U1.38
  Bottom 0.305: v61.4,47.9 v46,47.9 | v54.1,17.7 54,17.6 v27.2,17.6 | v58.7,32 61.7,32 62.1,31.6 v64.1,31.6
D+
  Top 0.305: U1.4 16.53,17.72 13.5,20.75 13.5,22.8 12.5,23.8 R1.2
D-
  Top 0.305: U1.3 16.53,18.52 14.4,20.7 14.4,24.4 12.6,26.2 R2.2
G1
  Top 0.25: UGREEN.5 58.25,47.95 58.14,47.95
  Top 0.3: 58.14,47.95 55.92,47.95 54.5,49.6 54.5,64.4 53.35,65.55 LED1.GREEN
G2  (via drill 0.36)
  Top 0.3: UGREEN.6 55.78,47.32 53.6,49.5 v53.6,62.2 | v64.3,62.2 LED2.GREEN
  Bottom 0.3: v53.6,62.2 v64.3,62.2
G3  (via drill 0.36)
  Top 0.3: UGREEN.7 55.62,46.68 52.8,49.5 v52.8,53.1 | LED3.GREEN 73.55,53.05 v73.6,53.1
  Bottom 0.3: v52.8,53.1 v73.6,53.1
G4  (via drill 0.36)
  Top 0.3: UGREEN.8 55.55,46.05 51.3,41.8 v51.3,40.6 | LED4.GREEN 77.05,40.55 v77.1,40.6
  Bottom 0.3: v51.3,40.6 v77.1,40.6
G5  (via drill 0.36)
  Top 0.3: UGREEN.9 55.71,45.41 52,41.7 v52,37.3 | LED5.GREEN 72.4,28.7 72.7,29 v72.7,37.3
  Bottom 0.3: v52,37.3 v72.7,37.3
G6  (via drill 0.36)
  Top 0.3: UGREEN.10 55.88,44.78 52.8,41.7 v52.8,24.8 | v63.3,24.8 LED6.GREEN
  Bottom 0.3: v52.8,24.8 v63.3,24.8
G7
  Top 0.3: UGREEN.11 56.04,44.14 53.6,41.7
  Top 0.305: 53.6,41.7 53.6,19 50.75,16.15 LED7.GREEN
G8  (via drill 0.36)
  Top 0.3: UGREEN.12 56.61,43.51 v56.4,43.4 | 41.2,22.64 v41.2,43.4
  Top 0.305: LED8.GREEN 38.25,19.69 41.2,22.64
  Bottom 0.305: v41.2,43.4 v56.4,43.4
G9  (via drill 0.36)
  Top 0.3: UGREEN.13 64.79,43.51 65,43.3 v65,28.7 | v30.9,28.7 30.25,28.1 30.2,28.05 LED9.GREEN
  Bottom 0.305: v30.9,28.7 36.3,28.7 36.6,28.4 64.7,28.4 v65,28.7
G10  (via drill 0.36)
  Top 0.3: UGREEN.14 64.96,44.14 65.8,43.3 65.8,42.7 v65.9,42.6 | LED10.GREEN 25.7,40.6
  Top 0.305: v30.7,42.6 28.55,40.55 LED10.GREEN
  Bottom 0.3: v30.7,42.6 v65.9,42.6
G11  (via drill 0.36)
  Top 0.3: UGREEN.15 65.22,44.78 66.8,43.2 v66.8,41.7 | v39.9,41.6 39.9,51.5 v38.4,53
  Top 0.305: LED11.GREEN 33.35,53.05 v33.4,53
  Bottom 0.3: v66.8,41.7 40,41.7 v39.9,41.6 | v33.4,53 v38.4,53
G12  (via drill 0.36)
  Top 0.3: UGREEN.16 65.41,45.41 68,48.1 v68,62.9 | LED12.GREEN 39.1,62.2 v39.8,62.9
  Bottom 0.305: v39.8,62.9 49.7,62.9 50.2,62.4 51.7,62.4 52.3,63 57.4,63 57.7,62.7 62.7,62.7 63.3,63.1 67.8,63.1 v68,62.9
GND  (via drill 0.36)
  Top 0.25: U3.9 17.9,39 18.1,38.8
  Top 0.254: U3.PGND3 17.65,41.45 U3.PAD | U3.PGND2 19.7,40.95 | 19,41.45 19.55,41.45 | U3.9 17.9,40.7 U3.PAD | U3.PGND4 15.1,41.45 15.1,41 | 15.1,41 15.1,40.3 15.15,40.25 15.15,40.95 15.1,41 | 15.1,41 16.75,41 16.8,41.05 17.25,41.05 U3.PAD
  Top 0.305: U4.5 19.1,67.2
  Bottom 0.406: J1.GND 44.26,3.9
  other vias: 51.2,52.2 51.3,44.7 50.3,37 55.5,39.6 65.5,55.3 58.2,51.6 43.5,57.1 38.1,51.6 66.6,2.6 36.3,4.6 11.65,4.05 14.3,6.9 17.6,7.55 12.3,14.9 13.3,18.6 19,27.75 25.9,25.5 32.2,24.3 36,12.75 83.8,31.4 91.8,31.5 93.8,33.2 83.6,26.1 91,27.5 84.5,41 32.4,63.8 41.9,73.05 50.2,76.1 23.9,60.9 6.1,67.4 71.9,71.2 77,60.4 13.9,75.1 12.3,69.8 24.6,74.2 25,70.2 4.5,22.4 6,23.3 6.7,20.9 68.3,32.8 69.6,19 18.05,61.7 42.3,35.9 89,8.8 57.7,7.8 83.5,13.8 87,20.3 57.7,18.7 62.9,39.2 86.4,71.4 80.3,72.9 54.6,69.1 51.9,31.1 57.5,30.9 48.3,53.9 17.15,54.55 28,44.4 28.8,35.9 23.85,15.85 20.3,14.8 24.65,23.75 13.9,51.9 98.6,1.5 98.5,12.9 82.6,1.2 67.7,25.1 65.6,15.9 78.4,48.4 82.4,52.9 98.3,38.7 98.6,50 95.1,44.1 84.7,35.6 87.6,27.3 96.8,67.8 98.2,78.4 84.6,78.5 70.5,78.6 55.1,78.6 41.8,78.35 48.6,71.2 59.3,66.7 72.3,67.1 81.5,67.7 42,67.5 1.5,78.5 1.5,67.8 10.8,60.6 69,44.8 68.6,39.2 38.4,11.9 1.75,17.05 1.7,1.8 1.7,9.7 9.5,2.1 10,30.8 1.4,33.1 1.4,45.9 10.05,46.8 66.3,69.3 13.5,78.4 77.4,14.1 77.7,26.9 42,19.1 39.8,35.9 41.8,47.3 61.5,49.7 57.1,54.8 28.9,39 31.7,32.5 42.3,38.3 39.7,38.3 57.2,60.8 42.8,62 30.1,11 28.8,21.2 22.8,12.4 19.8,20.2 45.3,46.9 65.2,48.2 51.9,26.9 1.2,57 4.8,53 3.9,61.9 20.3,67.2 24.1,67.2 90.2,22.3 45.3,23.6 72.2,13.4 18.1,67.7 20.15,65.2 14.6,68.1 58.6,72.3 32.85,2.3 18,2.4 20.5,2.4 7.9,42.55 8.5,34.5 6.3,38.15 10.95,41 11,44.15 29.35,29.55 22.1,29.85 20.9,51.8 20.75,47.7 17.25,47.05 19.85,41.2 17.4,41.2 89.8,37.2 15.95,21.25 33.4,78.35 33.4,72.45 27.7,69.35 28.1,71.55 18.1,35.4 14.2,39.65 16.45,37.75 22.35,78.45 23.5,18.15
  pour Top (isolate 0.203): 0,0 0,80 100,80 100,0
  pour Bottom (isolate 0.203): 0,0 0,80 100,80 100,0
ISCLK  (via drill 0.36)
  Top 0.305: U1.9 20.28,13.72 v20.3,13.7 | J1.3 41.69,6.55 40.55,7.7 29.7,7.7 28.75,6.85 v26.85,6.85
  Bottom 0.305: v20.3,13.7 20.3,13.5 v26.85,6.85
LATCH  (via drill 0.36)
  Top 0.3: UGREEN.4 56.61,48.59 v56.3,48.7 | 38.29,48.6 URED.4
  Top 0.305: UBLUE.4 48.61,31.59 46.8,33.4 46.8,36.2 | v23.9,27.6 23.85,27.55 U1.39 | 46.8,36.2 45.6,37.4 v44.7,37.4 | 46.8,36.2 46.8,38 47.3,38.5 v47.3,48.6 | 38.29,48.6 36.5,48.6 v36.4,48.7
  Bottom 0.305: v23.9,27.6 23.9,36.4 24.9,37.4 v44.7,37.4 | v36.4,48.7 37.1,48.7 37.2,48.6 v47.3,48.6 56.2,48.6 v56.3,48.7
MISO  (via drill 0.36)
  Top 0.3: v16.3,11.2 16.3,11.8 16.62,12.12
  Top 0.305: 16.62,12.12 U1.11 | J1.1 37.95,6.5 37.2,6.5 36.8,6.9 30.8,6.9 v30.7,7
  Bottom 0.305: v16.3,11.2 16.3,6.9 18.8,4.4 29.9,4.4 30.7,5.1 v30.7,7
MOSI  (via drill 0.36)
  Top 0.3: U1.10 16.52,12.92 v15.5,11.9
  Top 0.305: v34.6,2 39.85,2 41.75,3.95 41.75,4.01 J1.4
  Bottom 0.305: v15.5,11.9 15.5,6.3 19.3,2.4 20.5,1.2 33.8,1.2 v34.6,2
N$1
  Top 0.305: CF1.D- 6.8,25.4 7.4,26 9.12,26 R2.1
N$2
  Top 0.305: CF1.D+ 6.85,24.75 7.6,24 8.92,24 R1.1
N$3
  Top 0.305: U4.6 19.55,69.9 19.95,70.3 21.36,70.3 R14.2
N$4
  Top 0.3: U2.3 88.28,35.02 88.4,34.9 88.7,34.9
  Top 0.305: 88.7,34.9 89.5,34.9 90.34,35.74 C17.1 R4.2 | U2.3 88.3,36.3
N$5
  Top 0.305: D1.A CON1.POS1 91.33,51.03
N$6
  Top 0.305: D1.C 91.33,39.95 R4.1
N$7
  Top 0.305: U2.2 87.64,33.77 88.2,33.2 89.81,33.2 C4.1 X2.1
N$8  (via drill 0.36)
  Top 0.305: R16.1 20.82,74.08 | R16.1 21.14,72.34 v21.3,72.1 | R15.1 19.47,74.48 20,74 21.08,74 R16.1
  Bottom 0.305: T1.2 21.3,57.51 v21.3,72.1
N$10
  Top 0.305: X2.@1 85.58,30.64 C3.1 85.62,33.2 86.5,33.2 86.98,33.69 U2.1
N$12
  Top 0.254: U3.4 16.9,45.15 16.75,45.3 15.97,45.3 L1.1
N$14
  Top 0.254: U3.2 17.9,45.15 18,45.25 18.67,45.25 L1.@1
N$15
  Top 0.305: U4.8 18.1,72.62 R15.2
N$18  (via drill 0.36)
  Top 0.3: UGREEN.2 57.14,49.86 v56,51.1 | 43.68,49.2 URED.22 43.52,49.2 45.8,49.2 v47.2,50.6
  Bottom 0.305: v56,51.1 54.3,51.1 53.8,50.6 v47.2,50.6
N$19  (via drill 0.36)
  Top 0.3: UBLUE.2 49.24,32.86 48.8,33.3 v48.8,47.1 | v66.4,48.3 65.7,49 65.5,49.2 65.48,49.22 UGREEN.22
  Bottom 0.3: v48.8,47.1 65.5,47.1 v66.4,48.3
N$21
  Top 0.305: URED.23 45.66,49.86 46.1,50.3 46.1,51.4 R7.1
N$22
  Top 0.305: UGREEN.23 65.66,49.86 66.1,50.3 66.1,51.65 R6.1
N$23
  Top 0.305: UBLUE.23 57.86,32.86 58.4,33.4 58.4,34.7 R5.1
N$56
  Top 0.305: C15.1 31.96,3.92 X1.2 27.8,4.33 27.8,5.3 27.6,5.5 25.3,5.5 23.9,6.9 23.9,7 23.85,7.05 U1.17
N$57
  Top 0.305: C14.1 19.26,3.94 X1.1 19.24,5.24 19.6,5.6 21.6,5.6 23,7 23,10.57 U1.16
P1  (via drill 0.36)
  Top 0.305: U1.37 25.45,18.65 v25.4,18.6 | v64,7.7 64.5,7.4 81,7.4 96.5,23.3 96.5,25 97,25.5 J3.1
  Bottom 0.305: v25.4,18.6 25.4,13.4 37.3,1.6 57.8,1.7 v64,7.7
P2  (via drill 0.36)
  Top 0.305: U1.36 26.25,19.75 v26.3,19.8 | J3.2 97.91,22.9 97,22.9 81.2,6.9 63.3,6.9 v62.6,7.4
  Bottom 0.305: v26.3,19.8 26.3,13.3 37.5,2.1 57.3,2.2 v62.6,7.4
P3  (via drill 0.36)
  Top 0.305: J3.3 95.31,20.41 81.4,6.4 54.4,6.4 v49.3,11.5 | v33.4,16.9 29.37,16.9 U1.29
  Bottom 0.305: v49.3,11.5 44.5,16.9 v33.4,16.9
P4  (via drill 0.36)
  Top 0.305: J3.4 93.67,17.87 81.6,5.9 53.7,5.9 v48.1,11.5 | v32.4,16.1 29.37,16.1 U1.28
  Bottom 0.305: v48.1,11.5 43.9,16.1 43.7,16.3 34,16.3 33.7,16 32.5,16 v32.4,16.1
P5  (via drill 0.36)
  Top 0.305: U1.27 31.32,15.32 v31.7,15.2 | J3.5 97.89,15.3 91.8,15.3 81.8,5.4 53.1,5.4 v46.9,11.6
  Bottom 0.305: v46.9,11.6 43.6,15.2 42,15.2 41.6,14.8 33.1,14.8 32.7,15.2 v31.7,15.2
P6  (via drill 0.36)
  Top 0.305: J4.6 84.62,3.78 83.7,4.9 52.4,4.9 v42.9,14.3 | v27.2,14.5 29.33,14.5 U1.26
  Bottom 0.305: v27.2,14.5 32.2,14.5 32.4,14.3 v42.9,14.3
P7  (via drill 0.36)
  Top 0.305: J4.7 82.1,3.7 81.4,4.4 51.8,4.4 40.6,15.6 v39.8,15.6 | U1.32 29.37,19.3 32.5,19.3 35,16.8 v35,15.6
  Bottom 0.305: v35,15.6 v39.8,15.6
P8
  Top 0.305: J4.8 79.5,1.7 79.3,1.5 52.9,1.5 43.3,11.1 41.9,11.1 40.7,9.9 29.25,9.9 29.05,10.1 27.88,10.1 U1.22
P9  (via drill 0.36)
  Top 0.305: U1.1 17.85,21.55 v16.4,22.9 | v16.45,32 17.5,32 17.8,31.7 30.5,31.7 37.2,25 v37.2,23.3 | v42.8,23.2 42.8,23.1 v47,18.9 | v72.7,11.7 v76.1,11.7
  Bottom 0.305: v16.4,22.9 16.4,32.1 v16.45,32 | v37.2,23.3 42.7,23.3 v42.8,23.2 | v72.7,11.7 63.3,11.7 55.45,19.55 47.65,19.55 v47,18.9 47.1,18.9 | v76.1,11.7 77,10.9 J4.9
P10  (via drill 0.36)
  Top 0.305: U1.33 30.97,20.12 31.55,20.7 32.36,20.7 R3.2 32.35,20.75 v34,20.8
  Bottom 0.305: v34,20.8 73.3,20.8 74.5,19.3 74.5,2.56 J4.10
P_AREF  (via drill 0.36)
  Top 0.305: J3.AREF 96.93,28.03 95.8,27 95.8,23.4 80.8,7.9 69.1,7.9 68.5,8.6 v67.1,8.6 | U1.42 21.45,18.65 v21,18.2 | v29.8,6.2 36.1,6.2 37.2,5.1 42,5.1 43.1,6.2 43.1,6.9 43.9,7.7 45.5,7.7 47.6,5.6 47.6,4.8 v48.3,4.1
  Bottom 0.305: v21,18.2 21,15.6 v29.8,6.2 | v48.3,4.1 58.1,4.1 62.6,8.6 v67.1,8.6
P_ISS  (via drill 0.36)
  Top 0.3: U1.25 27.92,13.72 v27.9,13.7
  Top 0.305: J4.ISS 71.92,3.58 71.6,3.9 51.3,3.9 v41.6,13.5 | U1.25 29.37,13.7
  Bottom 0.305: v27.9,13.7 41.4,13.7 v41.6,13.5
R1  (via drill 0.36)
  Top 0.3: URED.5 36.05,47.95 35.6,48.4 | LED1.RED 47.05,65.55 46.3,64.8
  Top 0.305: 35.6,48.4 v35.6,55.4 | v46.3,55.4 46.3,64.8
  Bottom 0.305: v35.6,55.4 v46.3,55.4
R2  (via drill 0.36)
  Top 0.3: URED.6 35.88,47.32 34.9,48.3 v34.9,59.4 | LED2.RED 61,62.2 60.6,61.8 v60.6,59.4
  Bottom 0.3: v34.9,59.4 v60.6,59.4
R3  (via drill 0.36)
  Top 0.3: URED.7 35.72,46.68 34.2,48.2 v34.2,56.1 | v70.9,54.45 LED3.RED
  Bottom 0.3: v70.9,54.45 70.9,55.3 70.1,56.1 v34.2,56.1
R4  (via drill 0.36)
  Top 0.3: URED.8 35.15,46.05 v34.9,46.1 | LED4.RED 74.25,43.35 74,43.6 v74,44.8
  Bottom 0.3: v34.9,46.1 72.7,46.1 v74,44.8
R5  (via drill 0.36)
  Top 0.3: URED.9 36.61,45.41 34.7,43.5 v34.7,29.5 | v70.2,29.5 70.4,29.3 70.9,28.6 LED5.RED
  Bottom 0.305: v34.7,29.5 36.5,29.5 37.1,28.9 64,28.9 64.6,29.5 v70.2,29.5
R6  (via drill 0.36)
  Top 0.3: URED.10 36.78,44.78 35.5,43.5 v35.5,27.9
  Top 0.305: 61.6,19.04 LED6.RED 61.7,18.94 v61.7,26.1
  Bottom 0.305: v61.7,26.1 61.7,26.2 60,27.9 v35.5,27.9
R7  (via drill 0.36)
  Top 0.3: URED.11 37.04,44.14 36.3,43.4 v36.3,27.2
  Top 0.305: v51.4,25.8 51.4,18.5 49.25,16.35 LED7.RED
  Bottom 0.3: v36.3,27.2 49.7,27.2 v51.4,25.8
R8
  Top 0.3: 38.3,21.84 URED.12
  Top 0.305: LED8.RED 36.75,20.29 38.3,21.84
R9  (via drill 0.36)
  Top 0.3: v43.5,31 URED.13 | LED9.RED 27.6,28.8 27.5,28.9 v27.5,29.5
  Bottom 0.3: v43.5,31 29,31 v27.5,29.5
R10  (via drill 0.36)
  Top 0.3: URED.14 44.66,44.14 45,43.8 v45,40.8 | LED10.RED 24.2,40.6
  Top 0.305: 24.2,40.5 LED10.RED 24.25,41.35 24.7,41.8 28.6,41.8 v28.8,42
  Bottom 0.305: v45,40.8 44.9,40.7 30.1,40.7 v28.8,42
R11  (via drill 0.36)
  Top 0.3: URED.15 44.92,44.78 45.7,44 v45.7,40 | v32.5,39.9 32.5,46.1 | LED11.RED 26.75,53.05 v26.4,52.7
  Top 0.305: 32.5,46.1 31.9,46.7 26.9,46.7 v26.4,47.1
  Bottom 0.3: v45.7,40 32.9,40 v32.5,39.9
  Bottom 0.305: v26.4,47.1 v26.4,52.7
R12  (via drill 0.36)
  Top 0.3: URED.16 45.19,45.41 46.5,44.1 v46.5,39.2 | v31.7,39.1 v31.7,43.4 | LED12.RED 35.65,62.2 35.35,62.5 34.6,62.5
  Top 0.305: v34.1,62.5 34.6,62.5
  Bottom 0.3: v46.5,39.2 32.1,39.1 v31.7,39.1
  Bottom 0.305: v31.7,43.4 31.7,60.6 v34.1,62.5
RESET
  Top 0.305: U1.13 20.65,8.8 11.6,8.8 | J1.5 44.21,6.46 42.9,5.2 42.9,3.6 40.5,1.2 12.4,1.2 10.7,2.9 10.7,7.9 11.6,8.8 | SW1.3 9.01,11.39 11.6,8.8
RTC-ALARM  (via drill 0.36)
  Top 0.305: U2.7 87.64,41.73 87.9,42 87.9,44.1 86.9,45.1 83,45.1 81.9,44 81.9,24.3 83,23.2 R101.1 83,14.9 78.4,10.3 v70,10.3 | U1.21 27.05,8.95 27.35,8.65 28.35,8.65 28.95,9.25 41.95,9.25 v42.9,10.2
  Bottom 0.305: v42.9,10.2 69.9,10.2 v70,10.3
RTC-SCL  (via drill 0.36)
  Top 0.305: U2.6 88.28,41.59 88.4,41.7 88.4,44.4 87.1,45.7 82.8,45.7 81.3,44.2 81.3,19.49 R103.1 79.9,19.4 79.5,19 79.5,18.2 77.5,16.2 72.6,16.2 65,8.6 v54,8.6 | U1.18 24.65,8.55 25.45,7.65 28.85,7.65 29.45,8.2 43.9,8.25 v44.3,8.6
  Bottom 0.305: v44.3,8.6 v54,8.6
RTC-SDA  (via drill 0.36)
  Top 0.305: U2.5 88.94,44.66 87.3,46.3 82.6,46.3 80.7,44.5 80.7,22 80.1,21.4 78.84,21.4 R102.1 78.79,18.39 77.2,16.8 72.5,16.8 65.1,9.4 v53.3,9.4 | U1.19 25.45,8.7 25.95,8.15 28.65,8.15 29.4,8.75 43,8.75 v43.6,9.4
  Bottom 0.305: v43.6,9.4 v53.3,9.4
SCLK  (via drill 0.36)
  Top 0.3: UGREEN.3 57.08,49.22 v56,49.9 | v36.4,49.7 36.9,49.2 38.22,49.2 URED.3
  Top 0.305: UBLUE.3 49.08,32.22 48.3,33 | 48.3,33 48.3,46.1 48.1,46.3 v48.1,49.6 | v47.6,33.7 48.3,33 | v26.4,29.5 24.3,29.5 22.3,27.5 22.3,21.67 U1.41
  Bottom 0.305: v47.6,33.7 30.6,33.7 v26.4,29.5 | v36.4,49.7 37,49.7 37.1,49.6 v48.1,49.6 54.2,49.6 54.5,49.9 v56,49.9
SIN  (via drill 0.36)
  Top 0.305: URED.2 38.26,49.9 37.3,49.9 v36.3,50.9 | v32.7,50.9 30.3,50.9 v29.5,50.1 | v23,26.4 23,21.67 U1.40
  Bottom 0.305: v32.7,50.9 v36.3,50.9 | v29.5,50.1 29.4,50.1 28.3,49 28.3,47.4 23.1,42.2 v23,26.4
STAT1  (via drill 0.36)
  Top 0.305: v19.7,59.15 16.9,61.8 R105.1 17.81,62.9 18.1,63.2 U4.3 | v25.3,12.5 26.2,11.7 26.2,10.67 U1.20
  Bottom 0.305: v25.3,12.5 22,15.8 22,26.85 22,27.1 22,28.2 19.95,30.25 19.95,38.7 18.35,40.3 18.35,57.85 v19.7,59.15
STAT2  (via drill 0.36)
  Top 0.305: 19,63.31 R104.1 | v19,61.9 19,63.31 | U4.4 18.6,63.71 19,63.31 | U1.12 18.78,10.12 v18.75,10.15
  Bottom 0.305: v19,61.9 19,60.45 17.55,58.95 15.55,56.95 15.55,36.05 17.4,34.2 17.39,27.15 18.75,25.79 v18.75,10.15
VBAT
  Top 0.305: 16.2,72.1 C6.1 | U4.9 U4.10 16.9,69.9
  Top 0.61: 16.2,69.9 14.65,69.9 10.2,65.5 7.87,65.5 D2.A | 16.2,69.9 16.2,72.1 16.2,75.1 17.05,75.94 26.5,75.94 26.5,73.33 J2.1 | 16.2,69.9 16.9,69.9
VIN  (via drill 0.36)
  Top 0.254: U3.5 16.32,42.67 16.2,42.7 | U3.8 17.4,36.75 16.95,36.35 v14.25,36.35 | v10.05,39.2 12.2,39.2 R8.2
  Top 0.61: SW2.3 11.1,56.3 12.8,54.6 12.8,49.5 14.45,47.8 C1.1 | C1.1 14.71,42.77 | C1.1 16.2,42.7 | C1.1 14.45,41.45 13.8,40.8 13.05,40.8 12.35,40.1 R8.2
  Bottom 0.254: v14.25,36.35 11.25,36.35 10.05,37.5 v10.05,39.2
VUSB  (via drill 0.36)
  Top 0.3: U1.7 16.22,15.32 v16.2,15.3
  Top 0.305: CF1.VUSB 4.34,26.14 4.4,26.2 | v15,28.3 4.5,28.3 4.4,28.4 | U4.2 U4.1 16.9,65.5
  Top 0.61: 4.4,26.2 4.4,28.4 4.5,47.2 SW2.2 9.35,54.4 9.4,59.1 7.88,60.57 D2.C 7.89,62.2 9.1,62.2 12.4,65.5 16.9,65.5
  Bottom 0.305: v16.2,15.3 15,16.3 v15,28.3

### Text on the board
tPlace: ISS Notify V0.2 | open-notify.org | OSHW